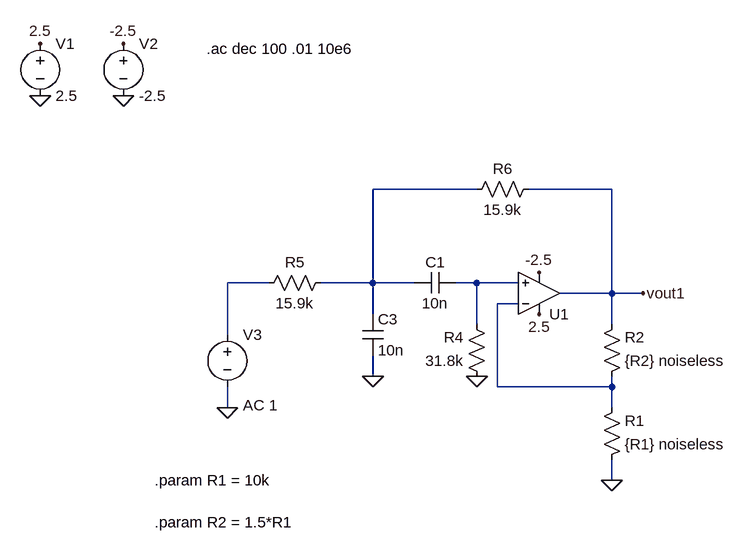
[diagram p0: schematic sallen_key_2nd_order_BP.asc]
sallen_key_2nd_order_BP.asc, the LTspice schematic file:
Version 4
SHEET 1 880 680
WIRE 256 -32 96 -32
WIRE 464 -32 336 -32
WIRE -64 112 -128 112
WIRE 96 112 96 -32
WIRE 96 112 16 112
WIRE 160 112 96 112
WIRE 256 112 224 112
WIRE 320 112 256 112
WIRE 464 128 464 -32
WIRE 464 128 384 128
WIRE 512 128 464 128
WIRE 320 144 288 144
WIRE 96 160 96 112
WIRE 256 176 256 112
WIRE 464 176 464 128
WIRE -128 192 -128 112
WIRE 96 256 96 224
WIRE 288 272 288 144
WIRE 464 272 464 256
WIRE 464 272 288 272
WIRE -128 304 -128 272
WIRE 464 304 464 272
WIRE 464 416 464 384
FLAG 352 160 2.5
FLAG 352 96 -2.5
FLAG 256 256 0
FLAG 512 128 vout1
FLAG -416 -256 2.5
FLAG -288 -256 -2.5
FLAG -416 -176 0
FLAG -288 -176 0
FLAG 464 416 0
FLAG 96 256 0
FLAG -128 304 0
SYMBOL Opamps\\UniversalOpamp2 352 128 M180
SYMATTR InstName U1
SYMATTR Value2 Avol=10Meg GBW=10Meg Slew=10Meg
SYMBOL cap 224 96 R90
WINDOW 0 0 32 VBottom 2
WINDOW 3 32 32 VTop 2
SYMATTR InstName C1
SYMATTR Value 10n
SYMBOL voltage -416 -272 R0
WINDOW 123 0 0 Left 0
WINDOW 39 0 0 Left 0
SYMATTR InstName V1
SYMATTR Value 2.5
SYMBOL voltage -288 -272 R0
WINDOW 123 0 0 Left 0
WINDOW 39 0 0 Left 0
SYMATTR InstName V2
SYMATTR Value -2.5
SYMBOL res 448 272 M180
WINDOW 0 36 76 Left 2
WINDOW 3 36 40 Left 2
SYMATTR InstName R2
SYMATTR Value {R2} noiseless
SYMBOL res 448 400 M180
WINDOW 0 36 76 Left 2
WINDOW 3 36 40 Left 2
SYMATTR InstName R1
SYMATTR Value {R1} noiseless
SYMBOL res 352 -48 R90
WINDOW 0 0 56 VBottom 2
WINDOW 3 32 56 VTop 2
SYMATTR InstName R6
SYMATTR Value 15.9k
SYMBOL res 272 272 R180
WINDOW 0 36 76 Left 2
WINDOW 3 36 40 Left 2
SYMATTR InstName R4
SYMATTR Value 31.8k
SYMBOL cap 80 160 R0
SYMATTR InstName C3
SYMATTR Value 10n
SYMBOL res -80 128 R270
WINDOW 0 32 56 VTop 2
WINDOW 3 0 56 VBottom 2
SYMATTR InstName R5
SYMATTR Value 15.9k
SYMBOL voltage -128 176 R0
WINDOW 123 24 124 Left 2
WINDOW 39 0 0 Left 0
SYMATTR InstName V3
SYMATTR Value ""
SYMATTR Value2 AC 1
TEXT -160 -248 Left 2 !.ac dec 100 .01 10e6
TEXT -240 416 Left 2 !.param R1 = 10k
TEXT -240 480 Left 2 !.param R2 = 1.5*R1

The netlist it stands for:
* sallen_key_2nd_order_BP.asc
XU1 N003 N004 2.5 -2.5 vout1 level.2 Avol=10Meg GBW=10Meg Slew=10Meg ilimit=25m rail=0 Vos=0 phimargin=45 en=0 enk=0 in=0 ink=0 Rin=500Meg  ; pins IN+ IN- V+ V- OUT
C1 N003 N001 10n
V1 2.5 0 2.5
V2 -2.5 0 -2.5
R2 N004 vout1 {R2} noiseless
R1 0 N004 {R1} noiseless
R6 vout1 N001 15.9k
R4 0 N003 31.8k
C3 N001 0 10n
R5 N002 N001 15.9k
V3 N002 0 AC 1
.ac dec 100 .01 10e6
.param R1 = 10k
.param R2 = 1.5*R1
.lib UniversalOpamps2.sub
.backanno
.end